# Altium schematic sheet main.SchDoc
size A
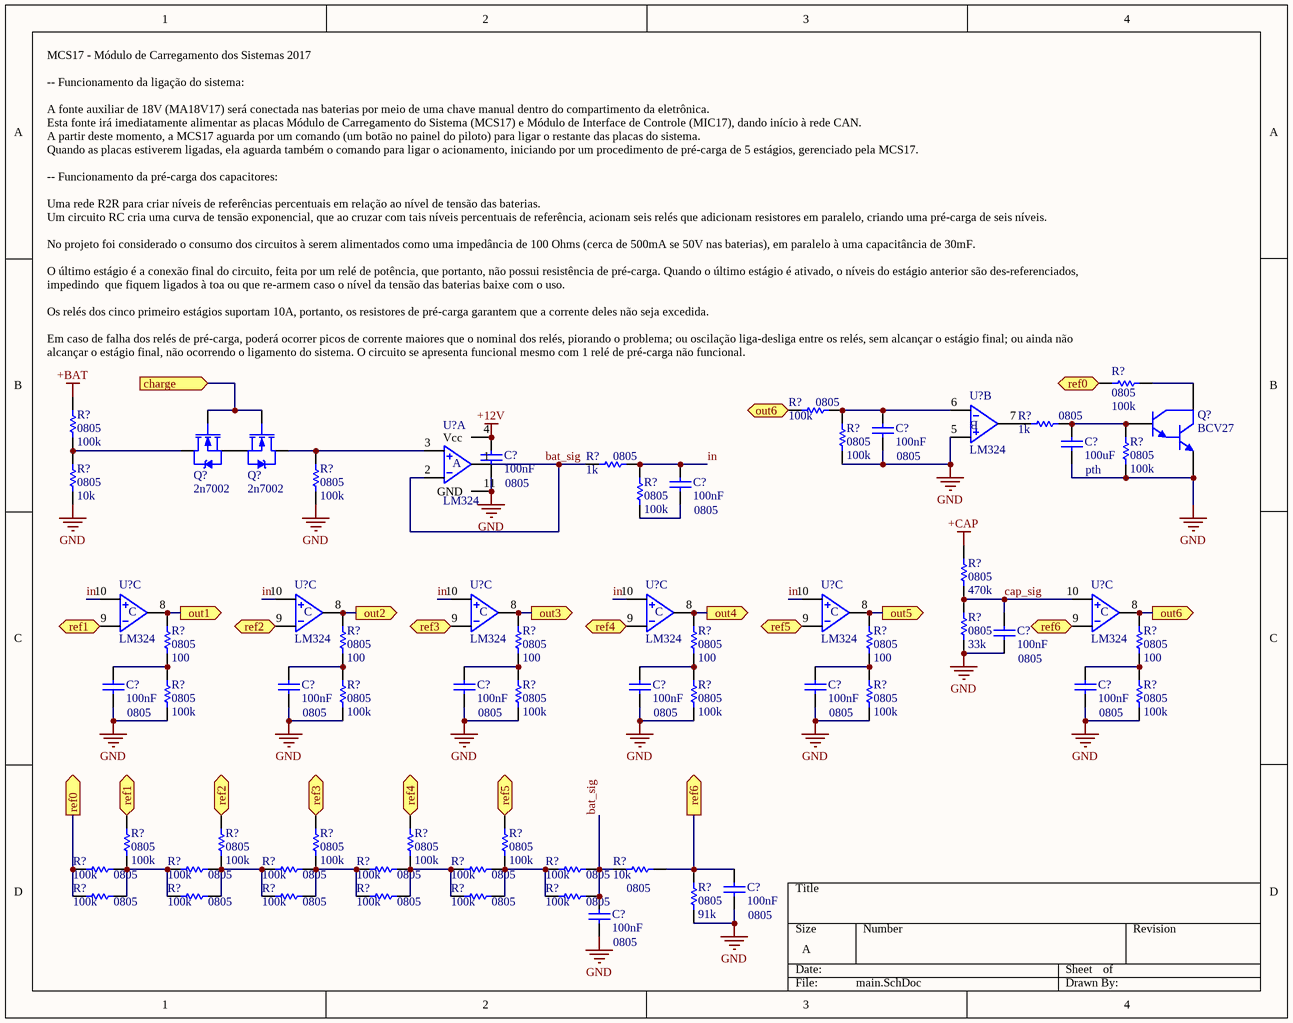
[diagram p0: main.SchDoc]

## Parts
(Parts that share a designator on the sheet are numbered #1, #2 ... from top to bottom, then left to right.)
C?#1  100nF  Footprint: 0805  [0805C]
C?#2  100uF  Footprint: pth  [0805C]
C?#3  100nF  Footprint: 0805  [0805C]
C?#4  100nF  Footprint: 0805  [0805C]
C?#5  100nF  Footprint: 0805  [0805C]
C?#6  100nF  Footprint: 0805  [0805C]
C?#7  100nF  Footprint: 0805  [0805C]
C?#8  100nF  Footprint: 0805  [0805C]
C?#9  100nF  Footprint: 0805  [0805C]
C?#10  100nF  Footprint: 0805  [0805C]
C?#11  100nF  Footprint: 0805  [0805C]
C?#12  100nF  Footprint: 0805  [0805C]
C?#13  100nF  Footprint: 0805  [0805C]
Q?#1  BCV27  [SOT95P240-3N]
Q?#2  2n7002  [TO-220/123]
Q?#3  2n7002  [TO-220/123]
R?#1  0805  value 100k  [0805C]
R?#2  0805  value 100k  [0805C]
R?#3  0805  value 100k  [0805C]
R?#4  0805  value 1k  [0805C]
R?#5  0805  value 100k  [0805C]
R?#6  0805  value 100k  [0805C]
R?#7  0805  value 1k  [0805C]
R?#8  0805  value 10k  [0805C]
R?#9  0805  value 100k  [0805C]
R?#10  0805  value 100k  [0805C]
R?#11  0805  value 470k  [0805C]
R?#12  0805  value 33k  [0805C]
R?#13  0805  value 100  [0805C]
R?#14  0805  value 100  [0805C]
R?#15  0805  value 100  [0805C]
R?#16  0805  value 100  [0805C]
R?#17  0805  value 100  [0805C]
R?#18  0805  value 100  [0805C]
R?#19  0805  value 100k  [0805C]
R?#20  0805  value 100k  [0805C]
R?#21  0805  value 100k  [0805C]
R?#22  0805  value 100k  [0805C]
R?#23  0805  value 100k  [0805C]
R?#24  0805  value 100k  [0805C]
R?#25  0805  value 100k  [0805C]
R?#26  0805  value 100k  [0805C]
R?#27  0805  value 100k  [0805C]
R?#28  0805  value 100k  [0805C]
R?#29  0805  value 100k  [0805C]
R?#30  0805  value 100k  [0805C]
R?#31  0805  value 100k  [0805C]
R?#32  0805  value 100k  [0805C]
R?#33  0805  value 100k  [0805C]
R?#34  0805  value 100k  [0805C]
R?#35  0805  value 100k  [0805C]
R?#36  0805  value 10k  [0805C]
R?#37  0805  value 91k  [0805C]
R?#38  0805  value 100k  [0805C]
R?#39  0805  value 100k  [0805C]
R?#40  0805  value 100k  [0805C]
R?#41  0805  value 100k  [0805C]
R?#42  0805  value 100k  [0805C]
R?#43  0805  value 100k  [0805C]
U?#1  LM324  [SOIC14-150(50)]  (part B of 4)
U?#2  LM324  [SOIC14-150(50)]  (part A of 4)
U?#3  LM324  [SOIC14-150(50)]  (part C of 4)
U?#4  LM324  [SOIC14-150(50)]  (part C of 4)
U?#5  LM324  [SOIC14-150(50)]  (part C of 4)
U?#6  LM324  [SOIC14-150(50)]  (part C of 4)
U?#7  LM324  [SOIC14-150(50)]  (part C of 4)
U?#8  LM324  [SOIC14-150(50)]  (part C of 4)

## Ports
charge (in), out1 (out), out2 (out), out3 (out), out4 (out), out5 (out), out6 (in), out6 (out), ref0 (in), ref0 (out), ref1 (in), ref1 (out), ref2 (in), ref2 (out), ref3 (in), ref3 (out), ref4 (in), ref4 (out), ref5 (in), ref5 (out), ref6 (in), ref6 (out)

## Nets
+12V: C?#3.2 U?#2.4(Vcc)
+BAT: R?#3.2
+CAP: R?#11.1
GND: C?#1.1 C?#2.1 C?#3.1 C?#5.1 C?#6.1 C?#7.1 C?#8.1 C?#9.1 C?#10.1 C?#11.1 C?#12.1 C?#13.1 Q?#1.3(E) R?#5.2 R?#6.1 R?#8.1 R?#9.1 R?#12.2 R?#19.2 R?#20.2 R?#21.2 R?#22.2 R?#23.2 R?#24.2 R?#37.2 U?#1.5(IN2+) U?#2.11(GND)
bat_sig: C?#13.2 R?#7.2 R?#35.1 R?#36.2 R?#43.1 U?#2.1(O1) U?#2.2(IN1-)
cap_sig: C?#5.2 R?#11.2 R?#12.1 U?#8.10(IN3+)
charge: Q?#2.1(G) Q?#3.1(G) ; port charge
in: C?#4.2 R?#7.1 R?#10.2 U?#3.10(IN3+) U?#4.10(IN3+) U?#5.10(IN3+) U?#6.10(IN3+) U?#7.10(IN3+)
out1: R?#13.1 U?#3.8(O3) ; port out1
out2: R?#14.1 U?#4.8(O3) ; port out2
out3: R?#15.1 U?#5.8(O3) ; port out3
out4: R?#16.1 U?#6.8(O3) ; port out4
out5: R?#17.1 U?#7.8(O3) ; port out5
out6: R?#2.2 R?#18.1 U?#8.8(O3) ; port out6
ref0: R?#1.1 R?#30.2 R?#38.2 ; port ref0
ref1: R?#25.1 U?#3.9(IN3-) ; port ref1
ref2: R?#26.1 U?#4.9(IN3-) ; port ref2
ref3: R?#27.1 U?#5.9(IN3-) ; port ref3
ref4: R?#28.1 U?#6.9(IN3-) ; port ref4
ref5: R?#29.1 U?#7.9(IN3-) ; port ref5
ref6: C?#12.2 R?#36.1 R?#37.1 U?#8.9(IN3-) ; port ref6
NetC?#1_2: C?#1.2 R?#2.1 R?#6.2 U?#1.6(IN2-)
NetC?#2_2: C?#2.2 Q?#1.2(B) R?#4.1 R?#5.1
NetC?#4_1: C?#4.1 R?#10.1
NetC?#6_2: C?#6.2 R?#13.2 R?#19.1
NetC?#7_2: C?#7.2 R?#14.2 R?#20.1
NetC?#8_2: C?#8.2 R?#15.2 R?#21.1
NetC?#9_2: C?#9.2 R?#16.2 R?#22.1
NetC?#10_2: C?#10.2 R?#17.2 R?#23.1
NetC?#11_2: C?#11.2 R?#18.2 R?#24.1
NetQ?#1_1: Q?#1.1(C) R?#1.2
NetQ?#2_2: Q?#2.2(D) R?#3.1 R?#8.2
NetQ?#2_3: Q?#2.3(S) Q?#3.3(S)
NetQ?#3_2: Q?#3.2(D) R?#9.2 U?#2.3(IN1+)
NetR?#4_2: R?#4.2 U?#1.7(O2)
NetR?#25_2: R?#25.2 R?#30.1 R?#31.2 R?#38.1 R?#39.2
NetR?#26_2: R?#26.2 R?#31.1 R?#32.2 R?#39.1 R?#40.2
NetR?#27_2: R?#27.2 R?#32.1 R?#33.2 R?#40.1 R?#41.2
NetR?#28_2: R?#28.2 R?#33.1 R?#34.2 R?#41.1 R?#42.2
NetR?#29_2: R?#29.2 R?#34.1 R?#35.2 R?#42.1 R?#43.2

## Notes on the sheet
- (near R?#1) MCS17 - Módulo de Carregamento dos Sistemas 2017
  -- Funcionamento da ligação do sistema:
  A fonte auxiliar de 18V (MA18V17) será conectada nas baterias por meio de uma chave manual dentro do compartimento da eletrônica.
  Esta fonte irá imediatamente alimentar as placas Módulo de Carregamento do Sistema (MCS17) e Módulo de Interface de Controle (MIC17), dando início à rede CAN.
  A partir deste momento, a MCS17 aguarda por um comando (um botão no painel do piloto) para ligar o restante das placas do sistema.
  Quando as placas estiverem ligadas, ela aguarda também o comando para ligar o acionamento, iniciando por um procedimento de pré-carga de 5 estágios, gerenciado pela MCS17.
  -- Funcionamento da pré-carga dos capacitores:
  Uma rede R2R para criar níveis de referências percentuais em relação ao nível de tensão das baterias.
  Um circuito RC cria uma curva de tensão exponencial, que ao cruzar com tais níveis percentuais de referência, acionam seis relés que adicionam resistores em paralelo, criando uma pré-carga de seis níveis.
  No projeto foi considerado o consumo dos circuitos à serem alimentados como uma impedância de 100 Ohms (cerca de 500mA se 50V nas baterias), em paralelo à uma capacitância de 30mF.
  O último estágio é a conexão final do circuito, feita por um relé de potência, que portanto, não possui resistência de pré-carga. Quando o último estágio é ativado, o níveis do estágio anterior são des-referenciados, impedindo  que fiquem ligados à toa ou que re-armem caso o nível da tensão das baterias baixe com o uso.
  Os relés dos cinco primeiro estágios suportam 10A, portanto, os resistores de pré-carga garantem que a corrente deles não seja excedida.
  Em caso de falha dos relés de pré-carga, poderá ocorrer picos de corrente maiores que o nominal dos relés, piorando o problema; ou oscilação liga-desliga entre os relés, sem alcançar o estágio final; ou ainda não alcançar o estágio final, não ocorrendo o ligamento do sistema. O circuito se apresenta funcional mesmo com 1 relé de pré-carga não funcional.
- (in symbol LM324, part A) A
- (in symbol LM324, part B) B
- (in symbol LM324, part C) C

## Library data of the parts
C?#1 C?#3-C?#13 = Cap: Capacitor; Voltage: 25V; Type: pth; LatestRevisionNote: Re-released for DXP Platform.; PackageReference: RAD-0.3; Value: 100nF
C?#2 = Cap: Capacitor; Voltage: 25V; Value: 100nF; LatestRevisionNote: Re-released for DXP Platform.; PackageReference: RAD-0.3; Type: pth
Q?#1 = NPN1: NPN Darlington Bipolar Transistor; LatestRevisionNote: Re-released for DXP Platform.; PackageReference: TO-92
Q?#2 Q?#3 = IRFZ46N: HEXFET Power MOSFET; Note: Pin 2 is electrically connected to pin 4.; Published: 8-Jun-2000; LatestRevisionDate: 17-Jul-2002; LatestRevisionNote: Re-released for DXP Platform.; DatasheetVersion: Aug-1997; PackageVersion: Feb-1997; PackageReference: TO-220AB; Publisher: Altium Limited; PackageDescription: TO, Thru-Hole, Vertical, Heatsink Mounted; 3 In-Line Leads; Pitch 2.54 mm; ComponentLink1Description: Manufacturer Link; ComponentLink1URL: http://www.irf.com/; ComponentLink2Description: Datasheet; ComponentLink2URL: http://www.irf.com/product-info/datasheets/data/irfz46n.pdf
R?#1-R?#43 = Res1: Resistor; LatestRevisionNote: Re-released for DXP Platform.; PackageReference: AXIAL-0.3; Type: 0805
U?#1-U?#8 = LM324: Quadruple Operational Amplifier